# Altium schematic sheet remote.SchDoc
size A4
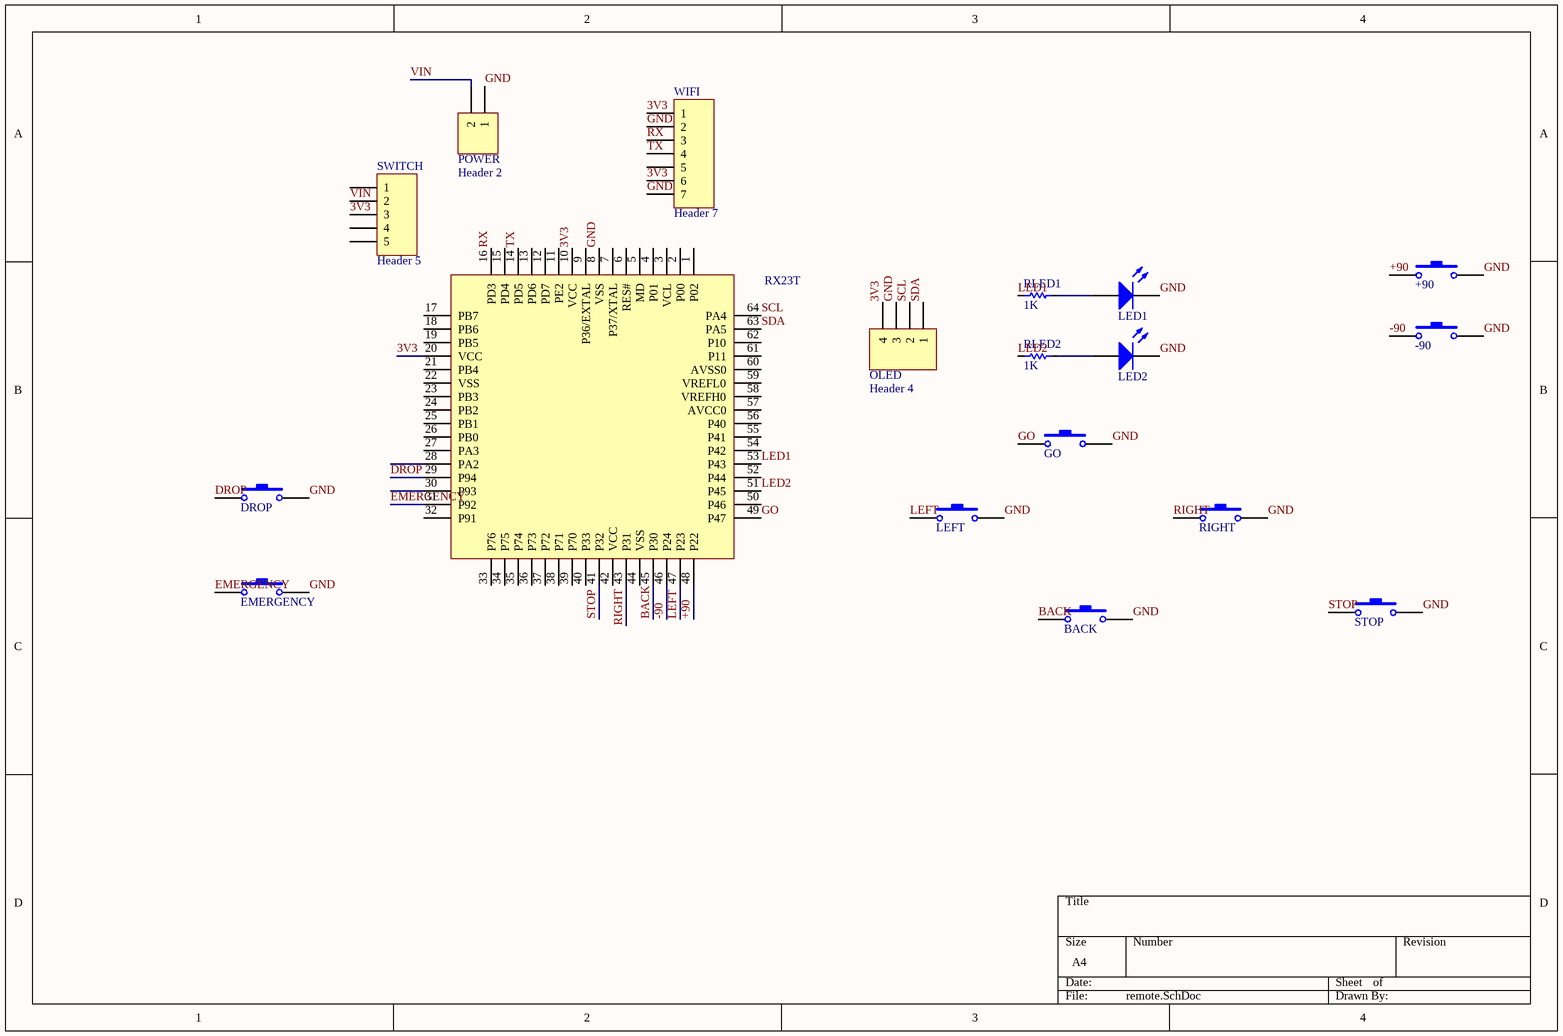
[diagram p0: remote.SchDoc]

## Parts
+90  贴片轻触开关  [SW-6*6]  (value not drawn)
-90  贴片轻触开关  [SW-6*6]  (value not drawn)
BACK  贴片轻触开关  [SW-6*6]  (value not drawn)
DROP  贴片轻触开关  [SW-6*6]  (value not drawn)
EMERGENCY  贴片轻触开关  [SW-6*6]  (value not drawn)
GO  贴片轻触开关  [SW-6*6]  (value not drawn)
LED1  LED  [LED 3MM-R]  (value not drawn)
LED2  LED  [LED 3MM-R]  (value not drawn)
LEFT  贴片轻触开关  [SW-6*6]  (value not drawn)
OLED  Header 4  [HDR1X4]
POWER  Header 2  [HDR1X2]
RIGHT  贴片轻触开关  [SW-6*6]  (value not drawn)
RLED1  1K  [RS 1/4W]
RLED2  1K  [RS 1/4W]
RX23T  RX23T  [RFR]  (value not drawn)
STOP  贴片轻触开关  [SW-6*6]  (value not drawn)
SWITCH  Header 5  [HDR1X5]
WIFI  Header 7  [HDR1X7]

## Nets
3V3: OLED.4 RX23T.10(VCC) RX23T.20(VCC) SWITCH.3 WIFI.1 WIFI.6
+90: +90.1 RX23T.48(P22)
-90: -90.1 RX23T.46(P24)
BACK: BACK.1 RX23T.45(P30)
DROP: DROP.1 RX23T.29(P94)
EMERGENCY: EMERGENCY.1 RX23T.31(P92)
GND: +90.2 -90.2 BACK.2 DROP.2 EMERGENCY.2 GO.2 LED1.2 LED2.2 LEFT.2 OLED.3 POWER.1 RIGHT.2 RX23T.8(VSS) STOP.2 WIFI.2 WIFI.7
GO: GO.1 RX23T.49(P47)
LED1: RLED1.1 RX23T.53(P43)
LED2: RLED2.1 RX23T.51(P45)
LEFT: LEFT.1 RX23T.47(P23)
RIGHT: RIGHT.1 RX23T.43(P31)
RX: RX23T.16(PD3) WIFI.3
SCL: OLED.2 RX23T.64(PA4)
SDA: OLED.1 RX23T.63(PA5)
STOP: RX23T.41(P32) STOP.1
TX: RX23T.14(PD5) WIFI.4
VIN: POWER.2 SWITCH.2
NetLED1_1: LED1.1 RLED1.2
NetLED2_1: LED2.1 RLED2.2

Not connected (* = marked no-connect by the designer): RX23T 1(P02) 2(P00) 3(VCL) 4(P01) 5(MD) 6(RES#) 7(P37/XTAL) 9(P36/EXTAL) 11(PE2) 12(PD7) 13(PD6) 15(PD4) 17(PB7) 18(PB6) 19(PB5) 21(PB4) 22(VSS) 23(PB3) 24(PB2) 25(PB1) 26(PB0) 27(PA3) 28(PA2) 30(P93) 32(P91) 33(P76) 34(P75) 35(P74) 36(P73) 37(P72) 38(P71) 39(P70) 40(P33) 42(VCC) 44(VSS) 50(P46) 52(P44) 54(P42) 55(P41) 56(P40) 57(AVCC0) 58(VREFH0) 59(VREFL0) 60(AVSS0) 61(P11) 62(P10); SWITCH 1 4 5; WIFI 5

## Library data of the parts
OLED = Header 4: Header, 4-Pin; LatestRevisionDate: 17-Jul-2002; LatestRevisionNote: Re-released for DXP Platform.; Publisher: Altium Limited
POWER = Header 2: Header, 2-Pin; LatestRevisionDate: 17-Jul-2002; LatestRevisionNote: Re-released for DXP Platform.; Publisher: Altium Limited
RLED1 RLED2 = R: R_0603
SWITCH = Header 5: Header, 5-Pin; LatestRevisionDate: 17-Jul-2002; LatestRevisionNote: Re-released for DXP Platform.; Publisher: Altium Limited
WIFI = Header 7: Header, 7-Pin; LatestRevisionDate: 17-Jul-2002; LatestRevisionNote: Re-released for DXP Platform.; Publisher: Altium Limited